# Altium schematic sheet Extra_Info.SchDoc
size A3; SheetNumber: 2; SheetTotal: 3
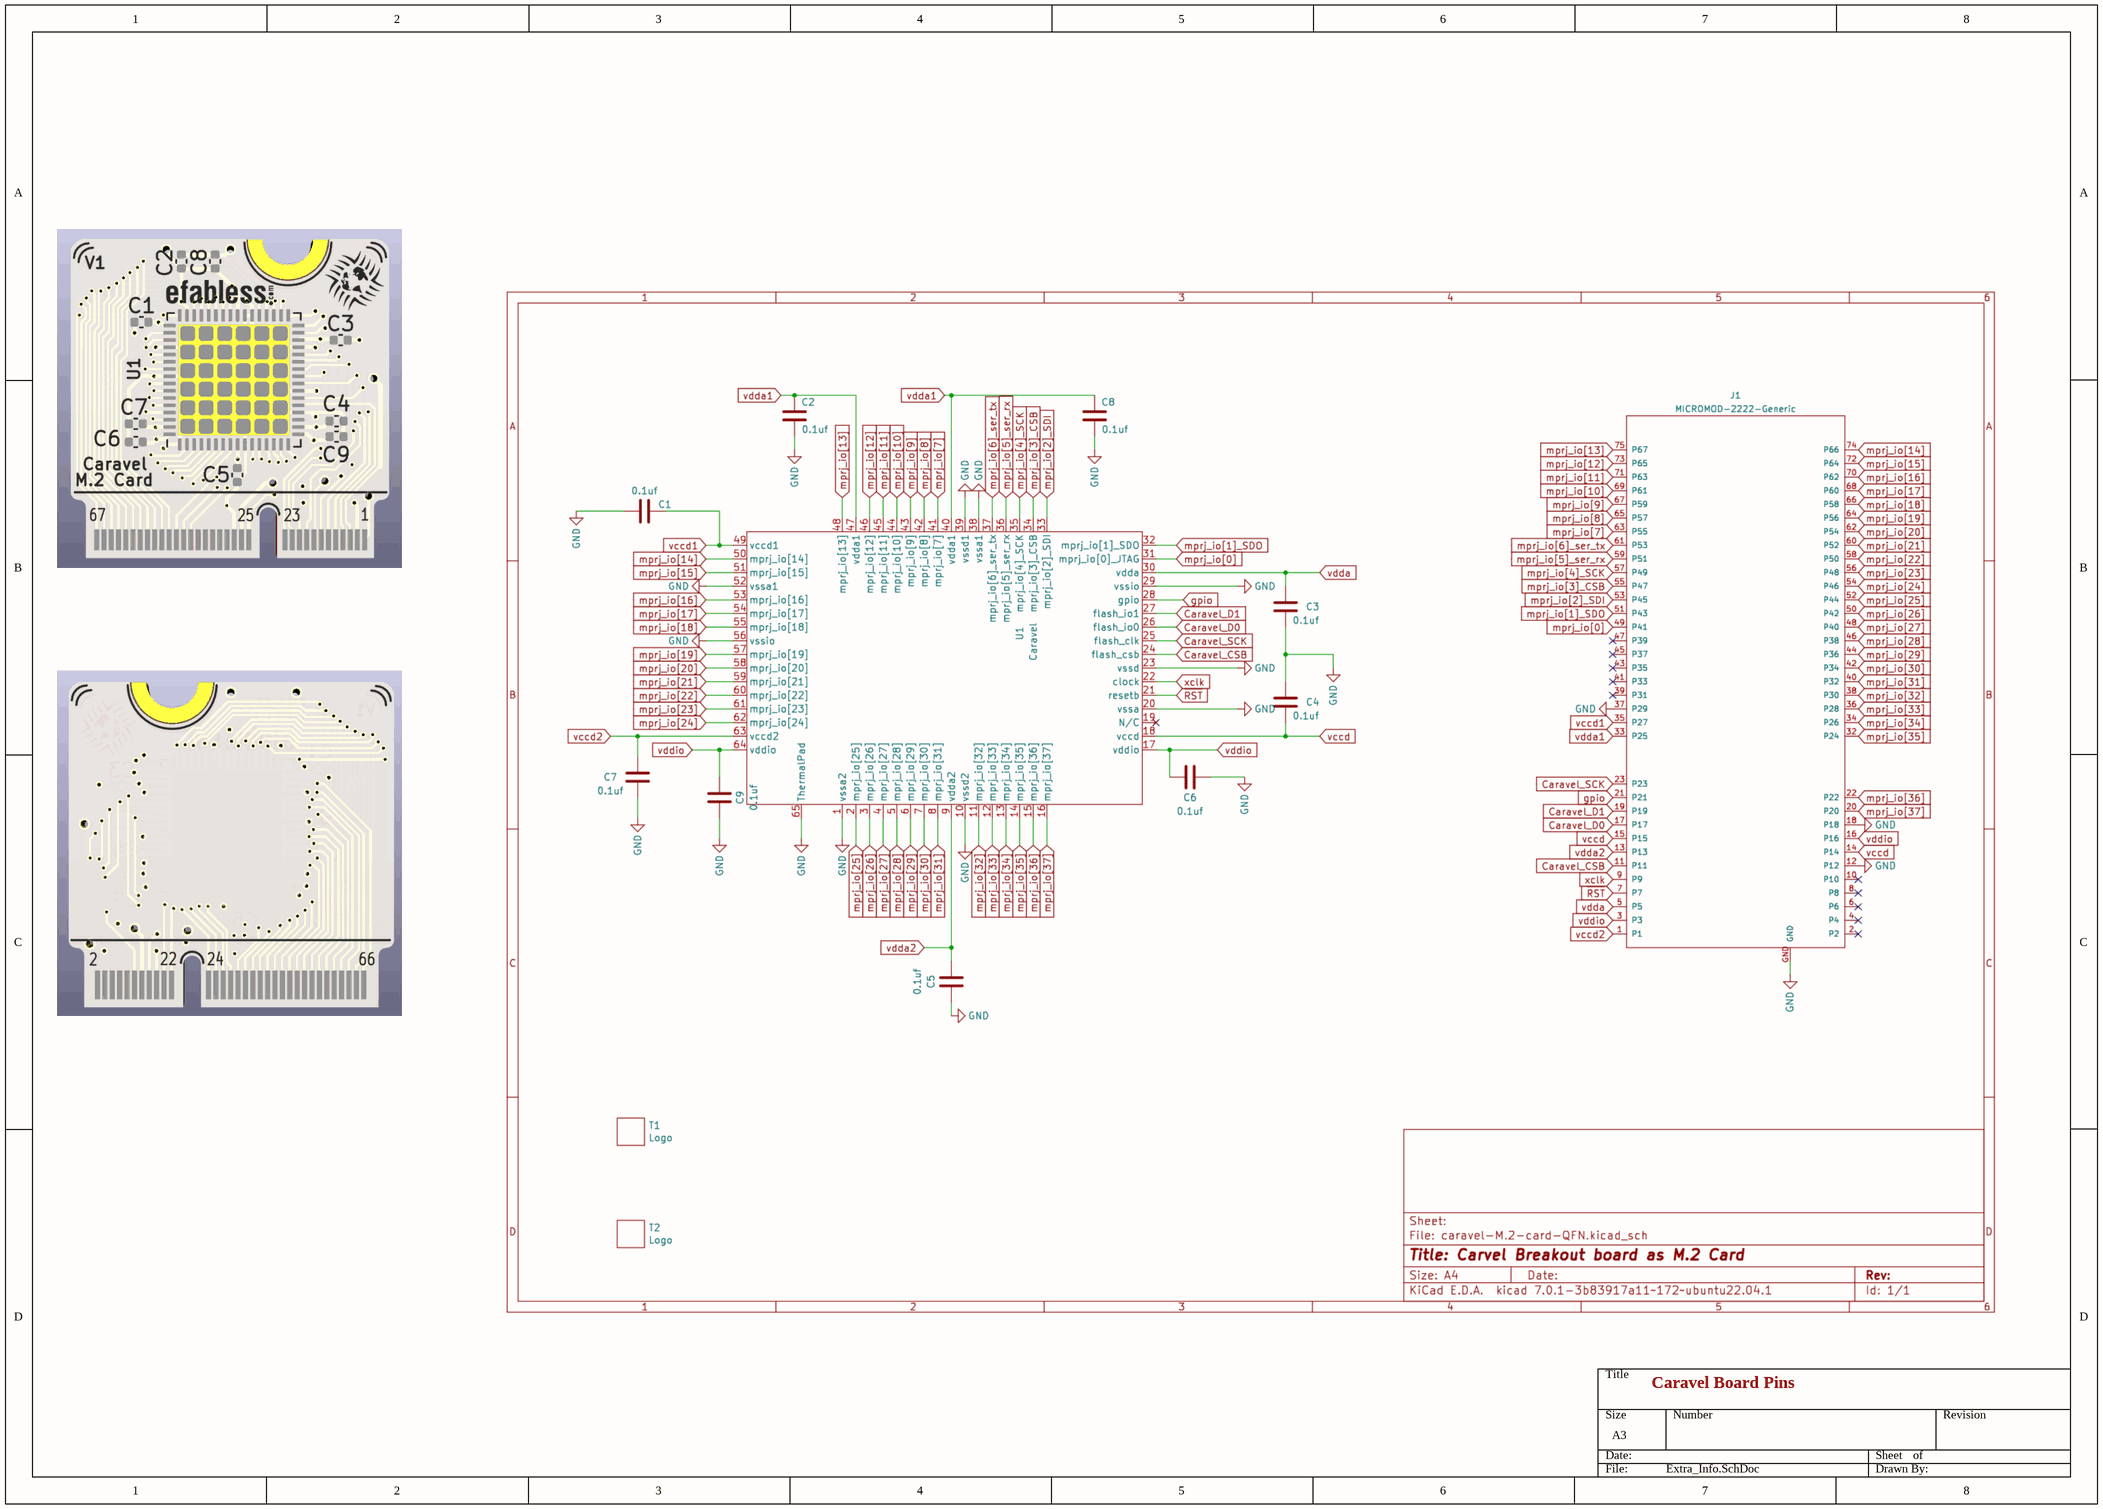
[diagram p0: Extra_Info.SchDoc]

## Notes on the sheet
- Caravel Board Pins